# Altium schematic sheet MM32F5277.SchDoc
size A2
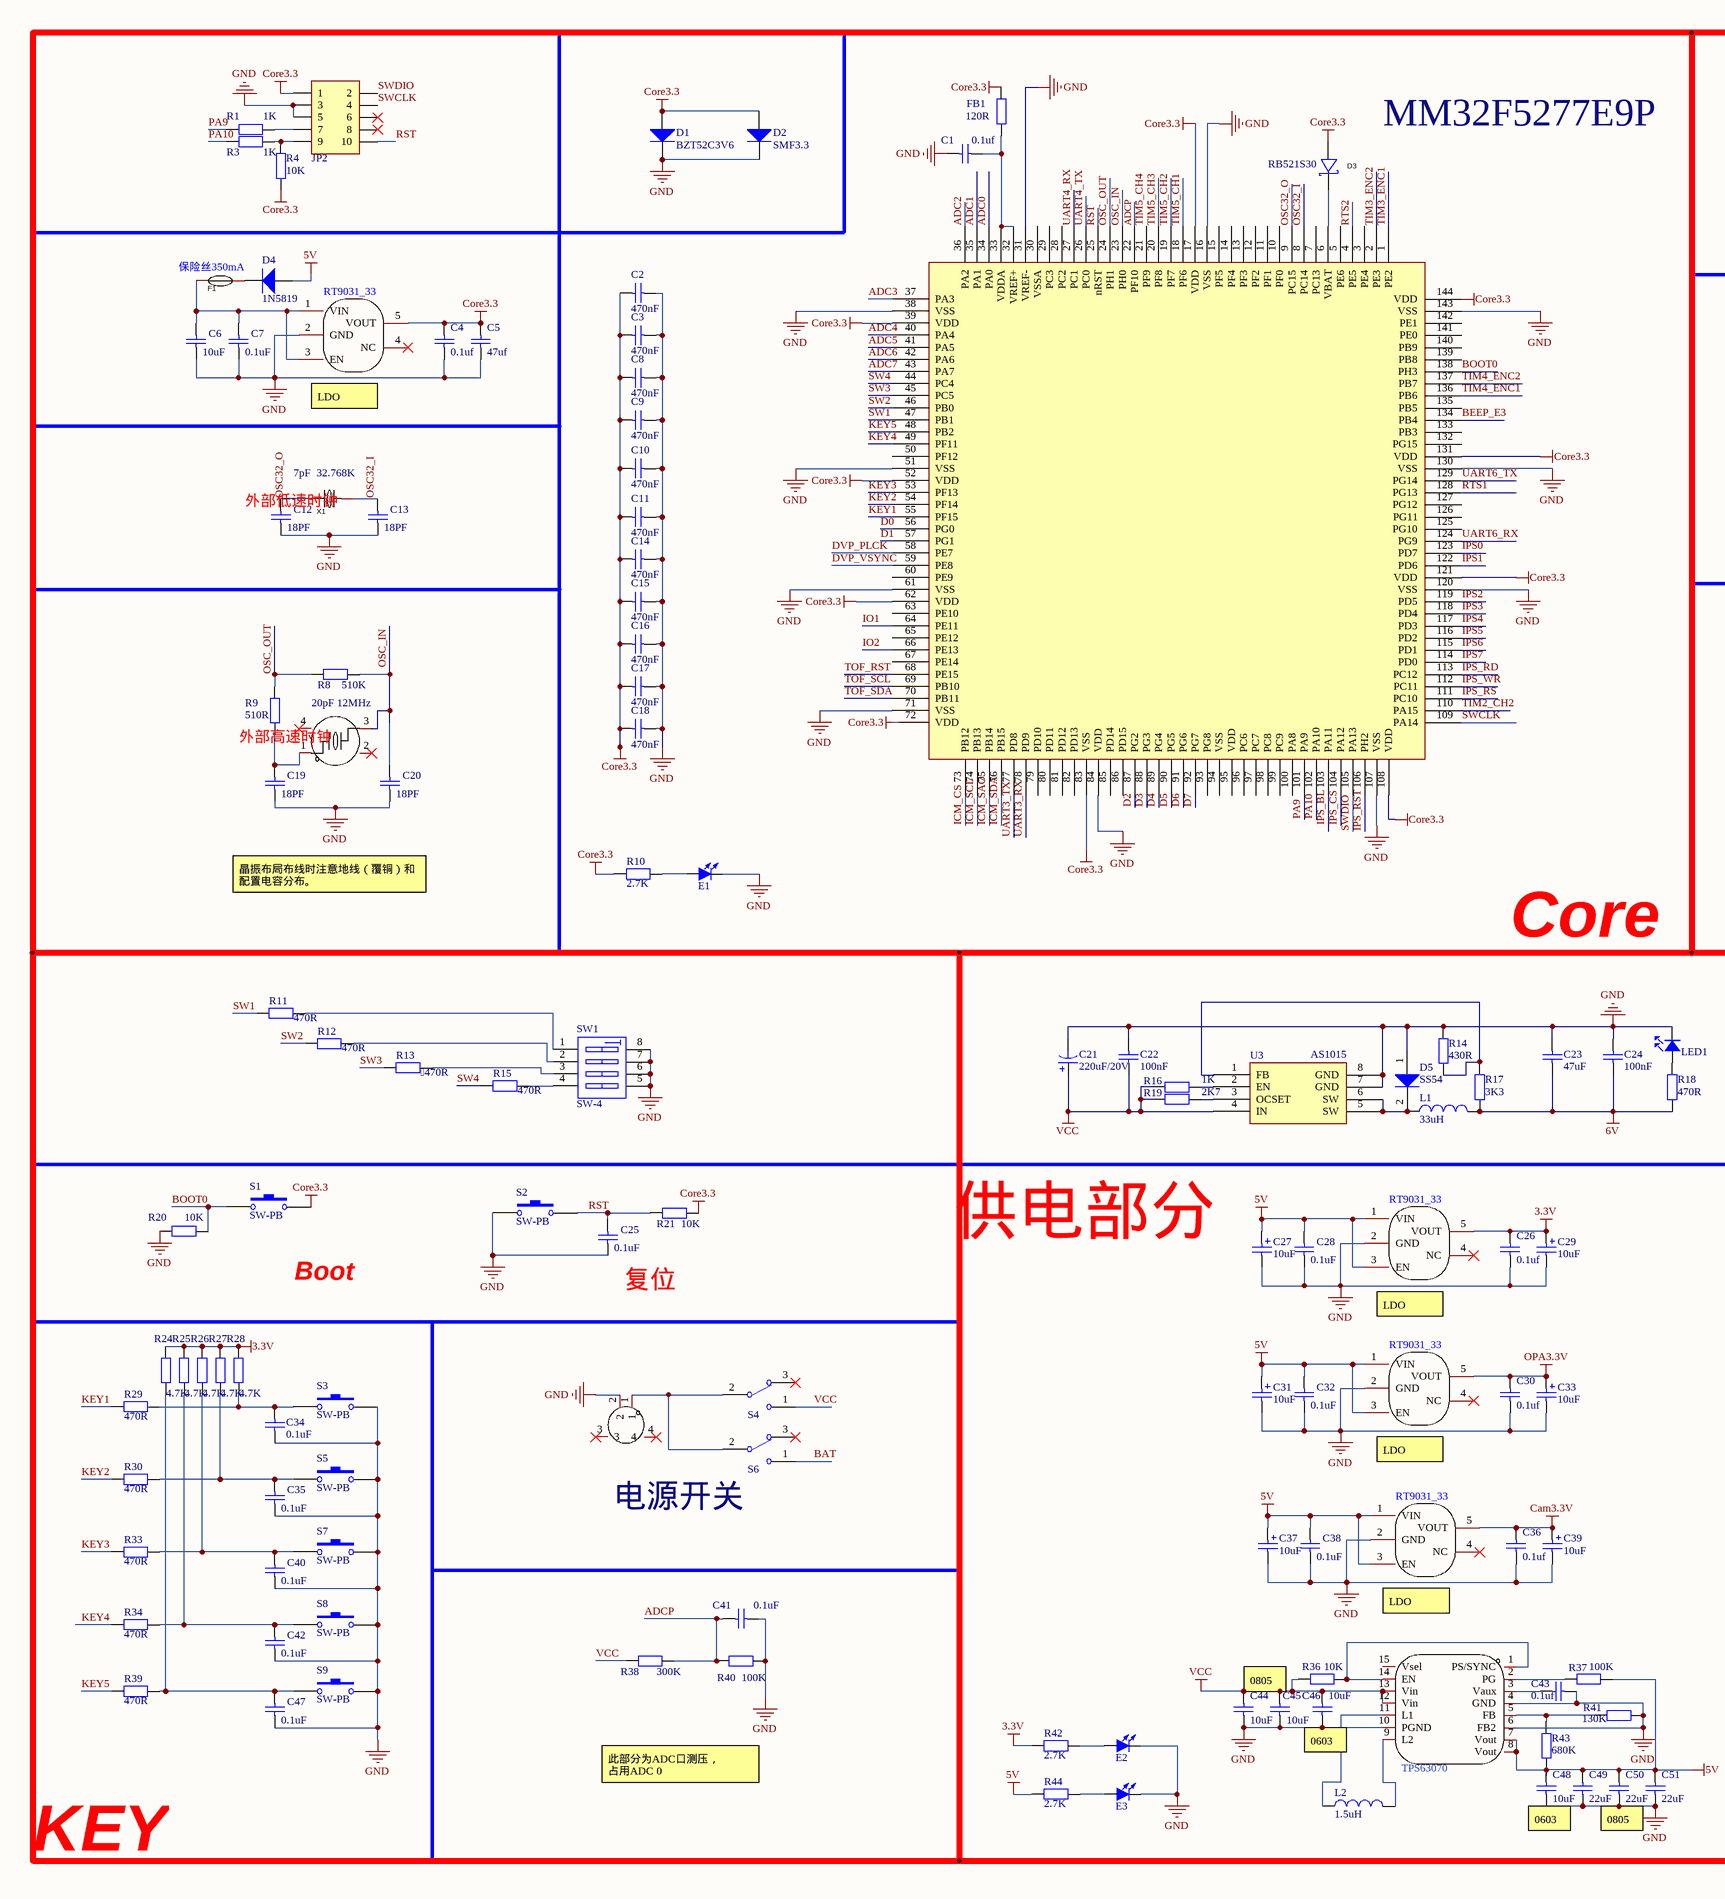
[diagram p0: MM32F5277.SchDoc, left]
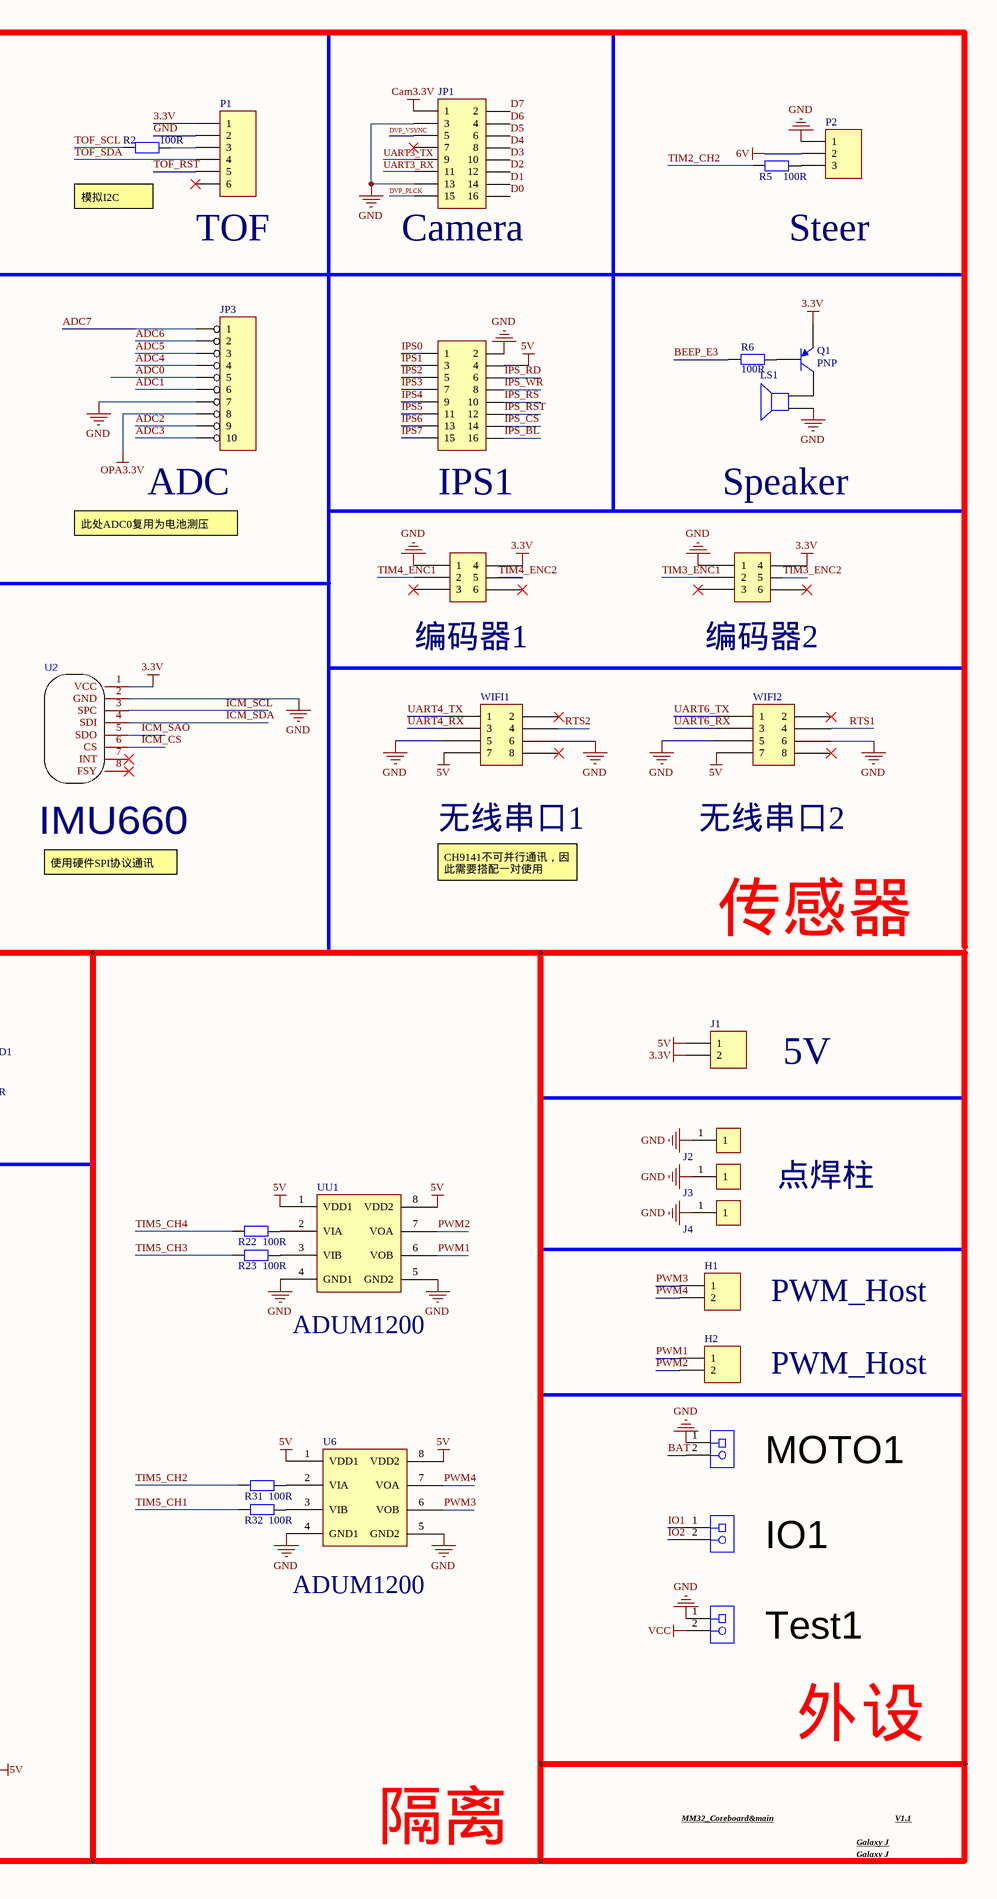
[diagram p1: MM32F5277.SchDoc, right]

## Parts
*1  MM32F5277E9P  [LQFP-144_L20.0-W20.0-P0.50-LS22.0-BL]
C1  value 0.1uf  [C 0603_L]  (hidden comment: Cap_4_1)
C2  Cap_3  [C 0603_L]  (value not drawn)
C3  Cap_3  [C 0603_L]  (value not drawn)
C4  value 0.1uf  [C 0603_L]  (hidden comment: Cap_4_1)
C5  Cap_3  [C 0603_L]  (value not drawn)
C6  value 10uF  [C 0603_L]  (hidden comment: Cap_4_1)
C7  Cap_3  [C 0603_L]  (value not drawn)
C8  Cap_3  [C 0603_L]  (value not drawn)
C9  Cap_3  [C 0603_L]  (value not drawn)
C10  Cap_3  [C 0603_L]  (value not drawn)
C11  Cap_3  [C 0603_L]  (value not drawn)
C12  value 18PF  [C 0603_L]  (hidden comment: Cap_4_1)
C13  value 18PF  [C 0603_L]  (hidden comment: Cap_4_1)
C14  Cap_3  [C 0603_L]  (value not drawn)
C15  Cap_3  [C 0603_L]  (value not drawn)
C16  Cap_3  [C 0603_L]  (value not drawn)
C17  Cap_3  [C 0603_L]  (value not drawn)
C18  Cap_3  [C 0603_L]  (value not drawn)
C19  value 18PF  [C 0603_L]  (hidden comment: Cap_4_1)
C20  value 18PF  [C 0603_L]  (hidden comment: Cap_4_1)
C21  220uF/20V  [CAP 5.0*10*12.5 - GD]
C22  100nF  [C 0603_L]
C23  47uF  [C 1206_L]
C24  100nF  [C 0603_L]
C25  Cap_3  [C 0603_L]  (value not drawn)
C26  value 0.1uf  [C 0603_L]  (hidden comment: Cap_4_1)
C27  value 10uF  [C3216A - duplicate - duplicate]  (hidden comment: Cap Pol1)
C28  Cap_3  [C 0603_L]  (value not drawn)
C29  value 10uF  [C3216A - duplicate - duplicate]  (hidden comment: Cap Pol1)
C30  value 0.1uf  [C 0603_L]  (hidden comment: Cap_4_1)
C31  value 10uF  [C3216A - duplicate - duplicate]  (hidden comment: Cap Pol1)
C32  Cap_3  [C 0603_L]  (value not drawn)
C33  value 10uF  [C3216A - duplicate - duplicate]  (hidden comment: Cap Pol1)
C34  Cap_3  [C 0603_L]  (value not drawn)
C35  Cap_3  [C 0603_L]  (value not drawn)
C36  value 0.1uf  [C 0603_L]  (hidden comment: Cap_4_1)
C37  value 10uF  [C3216A - duplicate - duplicate]  (hidden comment: Cap Pol1)
C38  Cap_3  [C 0603_L]  (value not drawn)
C39  value 10uF  [C3216A - duplicate - duplicate]  (hidden comment: Cap Pol1)
C40  Cap_3  [C 0603_L]  (value not drawn)
C41  Cap_3  [C 0603_L]  (value not drawn)
C42  Cap_3  [C 0603_L]  (value not drawn)
C43  value 0.1uf  [C 0603_L]  (hidden comment: Cap_4_1)
C44  value 10uF  [C 0805_L]  (hidden comment: Cap_4_1)
C45  value 10uF  [C 0805_L]  (hidden comment: Cap_4_1)
C46  value 10uF  [C 0603_L]  (hidden comment: Cap_4_1)
C47  Cap_3  [C 0603_L]  (value not drawn)
C48  value 10uF  [C 0603_L]  (hidden comment: Cap_4_1)
C49  value 22uF  [C 0805_L]  (hidden comment: Cap_4_1)
C50  value 22uF  [C 0805_L]  (hidden comment: Cap_4_1)
C51  value 22uF  [C 0805_L]  (hidden comment: Cap_4_1)
CN1  XT30PW-M  [XT30PW-M]  (value not drawn)
D1  BZT52C3V6  [SOD-123]
D2  SMF3.3  [SOD-123]
D3  RB521S30  [SOD-523_L1.2-W0.8-LS1.6-RD]
D4  1N5819  [SOD-123]
D5  SS54  [SMA]
E1  红色  [LED 0603]  (value not drawn)
E2  红色  [LED 0603]  (value not drawn)
E3  红色  [LED 0603]  (value not drawn)
F1  0603L050SLYR  [FU 0805]  (value not drawn)
FB1  value 120R  [R 0603_L]  (hidden comment: FB)
H1  PWM_Host  [HX2.54-2]
H2  PWM_Host  [HX2.54-2]
IO1  KF301-2P  [HDR1X2]  (value not drawn)
IPS1  Header 8X2  [HDR-8X2]  (value not drawn)
J1  5V  [HDR2.54-1X2]
J2  Column  [Column]  (value not drawn)
J3  Column  [Column]  (value not drawn)
J4  点焊柱  [Column]
JP1  Camera  [Cam_HDR2X8]
JP2  Header 5X2  [HDR2.54-LI-2x5P]  (value not drawn)
JP3  ADC  [HDR1X10]
L1  33uH  [L-SMD-0630]
L2  1.5uH  [L-SMD-0630]
LED1  LED-SM  [LED 0603]  (value not drawn)
LS1  Speaker  [BEEP 9x5.5mm]
mini1  编码器1  [DC-2.54-L-Z-6P]
mini*1  编码器2  [DC-2.54-L-Z-6P]
MOTO1  KF301-2P  [XT30UPB-F]  (value not drawn)
P1  TOF  [HDR1X6-M]
P2  Steer  [HDR2.54-LI-3P]
Q1  PNP  [SOT23-3L]
R1  value 1K  [R 0603_L]  (hidden comment: Res2)
R2  value 100R  [R 0603_L]  (hidden comment: Res2)
R3  value 1K  [R 0603_L]  (hidden comment: Res2)
R4  value 10K  [R 0603_L]  (hidden comment: Res2)
R5  value 100R  [R 0603_L]  (hidden comment: Res2)
R6  value 100R  [R 0603_L]  (hidden comment: Res2_3)
R8  value 510K  [R 0603_L]  (hidden comment: Res2)
R9  value 510R  [R 0603_L]  (hidden comment: Res2)
R10  value 2.7K  [R 0603_L]  (hidden comment: Res2_3)
R11  value 470R  [R 0603_L]  (hidden comment: Res2)
R12  value 470R  [R 0603_L]  (hidden comment: Res2)
R13  value 470R  [R 0603_L]  (hidden comment: Res2)
R14  430R  [R 0603_L]
R15  value 470R  [R 0603_L]  (hidden comment: Res2)
R16  1K  [R 0603_L]
R17  3K3  [R 0603_L]
R18  470R  [R 0603_L]
R19  2K7  [R 0603_L]
R20  value 10K  [R 0603_L]  (hidden comment: Res2)
R21  value 10K  [R 0603_L]  (hidden comment: Res2)
R22  value 100R  [R 0603_L]  (hidden comment: Res2)
R23  value 100R  [R 0603_L]  (hidden comment: Res2)
R24  value 4.7K  [R 0603_L]  (hidden comment: Res2)
R25  value 4.7K  [R 0603_L]  (hidden comment: Res2)
R26  value 4.7K  [R 0603_L]  (hidden comment: Res2)
R27  value 4.7K  [R 0603_L]  (hidden comment: Res2)
R28  value 4.7K  [R 0603_L]  (hidden comment: Res2)
R29  value 470R  [R 0603_L]  (hidden comment: Res2)
R30  value 470R  [R 0603_L]  (hidden comment: Res2)
R31  value 100R  [R 0603_L]  (hidden comment: Res2)
R32  value 100R  [R 0603_L]  (hidden comment: Res2)
R33  value 470R  [R 0603_L]  (hidden comment: Res2)
R34  value 470R  [R 0603_L]  (hidden comment: Res2)
R36  value 10K  [R 0603_L]  (hidden comment: Res2_3)
R37  value 100K  [R 0603_L]  (hidden comment: Res2_3)
R38  value 300K  [R 0603_L]  (hidden comment: Res2)
R39  value 470R  [R 0603_L]  (hidden comment: Res2)
R40  value 100K  [R 0603_L]  (hidden comment: Res2)
R41  value 130K  [R 0603_L]  (hidden comment: Res2_3)
R42  value 2.7K  [R 0603_L]  (hidden comment: Res2_3)
R43  value 680K  [R 0603_L]  (hidden comment: Res2_3)
R44  value 2.7K  [R 0603_L]  (hidden comment: Res2_3)
S1  SW-PB  [PTS810-3*4-CurvePin]
S2  SW-PB  [PTS810-3*4-CurvePin]
S3  SW-PB  [PTS810-3*4-CurvePin]
S4  SW-SPDT  [SS12D10]  (value not drawn)
S5  SW-PB  [PTS810-3*4-CurvePin]
S6  SW-SPDT  [SS12D10]  (value not drawn)
S7  SW-PB  [PTS810-3*4-CurvePin]
S8  SW-PB  [PTS810-3*4-CurvePin]
S9  SW-PB  [PTS810-3*4-CurvePin]
SW1  SW-4  [SOP-KEY4]
Test1  KF301-2P  [HDR2.54-1X2 - duplicate1]  (value not drawn)
U1  RT9013-33GB  [SOT-23-5]  (value not drawn)
U2  IMU660  [HDR1X6-M]
U3  AS1015  [SOP8_L]
U4  RT9013-33GB  [SOT-23-5]  (value not drawn)
U5  RT9013-33GB  [SOT-23-5]  (value not drawn)
U6  ADUM1200  [SOP8_L]
U7  RT9013-33GB  [SOT-23-5]  (value not drawn)
U8  TPS63070RNMR  [VQFN-HR-15_L3.0-W2.5-P0.50-BL_TPS63070RNMR]  (value not drawn)
UU1  ADUM1200  [SOP8_L]
WIFI1  无线串口1  [HDR2.54-LI-2x4P]
WIFI2  无线串口2  [HDR2.54-LI-2x4P]
X1  7pF  32.768K  [OSC 3215-2P]
X2  20pF 12MHz  [X3225-4]

## Nets
3.3V: C26.2 C29.1 J1.2 mini1.4 mini*1.4 P1.1 Q1.3(E) R24.1 R25.1 R26.1 R27.1 R28.1 R42.1 U2.1(VCC) U4.5(VOUT)
5V: C27.1 C28.2 C31.1 C32.2 C37.1 C38.2 C48.2 C49.1 C50.2 C51.2 D4.A IPS1.4 J1.1 R37.1 R43.1 R44.1 U4.1(VIN) U4.3(EN) U5.1(VIN) U5.3(EN) U6.1(VDD1) U6.8(VDD2) U7.1(VIN) U7.3(EN) U8.7(Vout) U8.8(Vout) UU1.1(VDD1) UU1.8(VDD2) WIFI1.7 WIFI2.7
6V: C23.1 C24.1 L1.2 P2.2 R17.1 R18.2
Cam3.3V: C36.2 C39.1 JP1.1 U7.5(VOUT)
Core3.3: *1.17(VDD) *1.39(VDD) *1.52(VDD) *1.62(VDD) *1.72(VDD) *1.83(VSS) *1.108(VDD) *1.121(VDD) *1.131(VDD) *1.144(VDD) C2.2 C3.2 C4.2 C5.2 C8.2 C9.2 C10.2 C11.2 C14.2 C15.2 C16.2 C17.2 C18.2 D1.A D2.A D3.2(A) FB1.2 JP2.1 R4.1 R10.1 R21.2 S1.2 U1.5(VOUT)
GND: *1.16(VSS) *1.31(VREF-) *1.38(VSS) *1.51(VSS) *1.61(VSS) *1.71(VSS) *1.84(VDD) *1.107(VSS) *1.120(VSS) *1.130(VSS) *1.143(VSS) C1.2 C2.1 C3.1 C4.1 C5.1 C6.1 C7.1 C8.1 C9.1 C10.1 C11.1 C12.1 C13.1 C14.1 C15.1 C16.1 C17.1 C18.1 C19.1 C20.1 C21.2 C22.2 C23.2 C24.2 C25.1 C26.1 C27.2 C28.1 C29.2 C30.1 C31.2 C32.1 C33.2 C34.1 C35.1 C36.1 C37.2 C38.1 C39.2 C40.1 C41.1 C42.1 C43.1 C44.1 C45.1 C46.1 C47.1 C48.1 C49.2 C50.1 C51.1 CN1.2 D1.K D2.K D5.1(A) E1.2(K) E2.2(K) E3.2(K) IPS1.2 J2.1 J3.1 J4.1 JP1.3 JP1.13 JP2.3 JP2.5 JP3.7 LED1.2 LS1.1 mini1.1 mini*1.1 MOTO1.1 P1.2 P2.1 R14.2 R20.1 R40.2 R41.2 S2.1 S3.2 S5.2 S7.2 S8.2 S9.2 SW1.5(B4) SW1.6(B3) SW1.7(B2) SW1.8(B1) Test1.1 U1.2(GND) U2.2(GND) U3.7(GND) U3.8(GND) U4.2(GND) U5.2(GND) U6.4(GND1) U6.5(GND2) U7.2(GND) U8.4(GND) U8.6(FB2) U8.10(PGND) UU1.4(GND1) UU1.5(GND2) WIFI1.5 WIFI1.6 WIFI2.5 WIFI2.6
OPA3.3V: C30.2 C33.1 JP3.8 U5.5(VOUT)
VCC: C21.1 C22.1 C44.2 C45.2 C46.2 R16.2 R19.2 R36.2 R38.1 S4.1 Test1.2 U3.4(IN) U8.12(Vin) U8.13(Vin)
ADC0: *1.34(PA0) JP3.5
ADC1: *1.35(PA1) JP3.6
ADC2: *1.36(PA2) JP3.9
ADC3: *1.37(PA3) JP3.10
ADC4: *1.40(PA4) JP3.4
ADC5: *1.41(PA5) JP3.3
ADC6: *1.42(PA6) JP3.2
ADC7: *1.43(PA7) JP3.1
ADCP: *1.22(PF10) C41.2 R38.2 R40.1
BAT: MOTO1.2 S6.1
BEEP_E3: *1.134(PB4) R6.1
BOOT0: *1.138(PH3) R20.2 S1.1
D0: *1.56(PG0) JP1.16
D1: *1.57(PG1) JP1.14
D2: *1.87(PG2) JP1.12
D3: *1.88(PG3) JP1.10
D4: *1.89(PG4) JP1.8
D5: *1.90(PG5) JP1.6
D6: *1.91(PG6) JP1.4
D7: *1.92(PG7) JP1.2
DVP_PLCK: *1.58(PE7) JP1.15
DVP_VSYNC: *1.59(PE8) JP1.5
ICM_CS: *1.73(PB12) U2.6(CS)
ICM_SAO: *1.75(PB14) U2.5(SDO)
ICM_SCL: *1.74(PB13) U2.3(SPC)
ICM_SDA: *1.76(PB15) U2.4(SDI)
IO1: *1.64(PE11) IO1.1
IO2: *1.66(PE13) IO1.2
IPS0: *1.123(PD7) IPS1.1
IPS1: *1.122(PD6) IPS1.3
IPS2: *1.119(PD5) IPS1.5
IPS3: *1.118(PD4) IPS1.7
IPS4: *1.117(PD3) IPS1.9
IPS5: *1.116(PD2) IPS1.11
IPS6: *1.115(PD1) IPS1.13
IPS7: *1.114(PD0) IPS1.15
IPS_BL: *1.103(PA11) IPS1.16
IPS_CS: *1.104(PA12) IPS1.14
IPS_RD: *1.113(PC12) IPS1.6
IPS_RS: *1.111(PC10) IPS1.10
IPS_RST: *1.106(PH2) IPS1.12
IPS_WR: *1.112(PC11) IPS1.8
KEY1: *1.55(PF15) R29.1
KEY2: *1.54(PF14) R30.1
KEY3: *1.53(PF13) R33.1
KEY4: *1.49(PF11) R34.1
KEY5: *1.48(PB2) R39.1
OSC32_I: *1.8(PC14) C13.2 X1.1
OSC32_O: *1.9(PC15) C12.2 X1.2
OSC_IN: *1.23(PH0) C20.2 R8.2 X2.3
OSC_OUT: *1.24(PH1) R8.1 R9.2
PA9: *1.101(PA9) R1.1
PA10: *1.102(PA10) R3.1
PWM1: H2.1 UU1.6(VOB)
PWM2: H2.2 UU1.7(VOA)
PWM3: H1.1 U6.6(VOB)
PWM4: H1.2 U6.7(VOA)
RST: *1.25(nRST) C25.2 JP2.10 R21.1 S2.2
RTS1: *1.128(PG13) WIFI2.4
RTS2: *1.4(PE5) WIFI1.4
SW1: *1.47(PB1) R11.1
SW2: *1.46(PB0) R12.1
SW3: *1.45(PC5) R13.1
SW4: *1.44(PC4) R15.1
SWCLK: *1.109(PA14) JP2.4
SWDIO: *1.105(PA13) JP2.2
TIM2_CH2: *1.110(PA15) R5.1
TIM3_ENC1: *1.1(PE2) mini*1.2
TIM3_ENC2: *1.2(PE3) mini*1.5
TIM4_ENC1: *1.136(PB6) mini1.2
TIM4_ENC2: *1.137(PB7) mini1.5
TIM5_CH1: *1.18(PF6) R32.1
TIM5_CH2: *1.19(PF7) R31.1
TIM5_CH3: *1.20(PF8) R23.1
TIM5_CH4: *1.21(PF9) R22.1
TOF_RST: *1.68(PE15) P1.5
TOF_SCL: *1.69(PB10) R2.1
TOF_SDA: *1.70(PB11) P1.4
UART3_RX: *1.78(PD9) JP1.11
UART3_TX: *1.77(PD8) JP1.9
UART4_RX: *1.27(PC1) WIFI1.3
UART4_TX: *1.26(PC0) WIFI1.1
UART6_RX: *1.124(PG9) WIFI2.3
UART6_TX: *1.129(PG14) WIFI2.1
Net*1_6: *1.6(VBAT) D3.1(K)
Net*1_32: *1.32(VREF+) *1.33(VDDA) C1.1 FB1.1
NetC6_2: C6.2 C7.2 F1.1 U1.1(VIN) U1.3(EN)
NetC19_2: C19.2 R9.1 X2.1
NetC34_2: C34.2 R28.2 R29.2 S3.1
NetC35_2: C35.2 R27.2 R30.2 S5.1
NetC40_2: C40.2 R26.2 R33.2 S7.1
NetC42_2: C42.2 R25.2 R34.2 S8.1
NetC43_2: C43.2 U8.3(Vaux)
NetC47_2: C47.2 R24.2 R39.2 S9.1
NetCN1_1: CN1.1 S4.2 S6.2
NetD4_K: D4.K F1.2
NetD5_2: D5.2(K) L1.1 U3.5(SW) U3.6(SW)
NetE1_1: E1.1(A) R10.2
NetE2_1: E2.1(A) R42.2
NetE3_1: E3.1(A) R44.2
NetJP2_7: JP2.7 R1.2
NetJP2_9: JP2.9 R3.2 R4.2
NetL2_1: L2.1 U8.11(L1)
NetL2_2: L2.2 U8.9(L2)
NetLED1_1: LED1.1 R18.1
NetLS1_2: LS1.2 Q1.1(C)
NetP1_3: P1.3 R2.2
NetP2_3: P2.3 R5.2
NetQ1_2: Q1.2(B) R6.2
NetR11_2: R11.2 SW1.1(A1)
NetR12_2: R12.2 SW1.2(A2)
NetR13_2: R13.2 SW1.3(A3)
NetR14_1: R14.1 R17.2 U3.1(FB)
NetR15_2: R15.2 SW1.4(A4)
NetR16_1: R16.1 U3.2(EN)
NetR19_1: R19.1 U3.3(OCSET)
NetR22_2: R22.2 UU1.2(VIA)
NetR23_2: R23.2 UU1.3(VIB)
NetR31_2: R31.2 U6.2(VIA)
NetR32_2: R32.2 U6.3(VIB)
NetR36_1: R36.1 U8.1(PS/SYNC) U8.14(EN)
NetR37_2: R37.2 U8.2(PG)
NetR41_1: R41.1 R43.2 U8.5(FB)

Not connected (* = marked no-connect by the designer): *1 3(PE4) 5(PE6) 7(PC13) 10(PF0) 11(PF1) 12(PF2) 13(PF3) 14(PF4) 15(PF5) 28(PC2) 29(PC3) 30(VSSA) 50(PF12) 60(PE9) 63(PE10) 65(PE12) 67(PE14) 79(PD10) 80(PD11) 81(PD12) 82(PD13) 85(PD14) 86(PD15) 93(PG8) 94(VSS) 95(VDD) 96(PC6) 97(PC7) 98(PC8) 99(PC9) 100(PA8) 125(PG10) 126(PG11) 127(PG12) 132(PG15) 133(PB3) 135(PB5) 139(PB8) 140(PB9) 141(PE0) 142(PE1); CN1 3* 4*; JP1 7*; JP2 6* 8*; mini1 3* 6*; mini*1 3* 6*; P1 6*; S4 3*; S6 3*; U1 4(NC)*; U2 7(INT)* 8(FSY)*; U4 4(NC)*; U5 4(NC)*; U7 4(NC)*; U8 15(Vsel); WIFI1 2* 8*; WIFI2 2* 8*; X2 2(GND)* 4(GND)*

## Notes on the sheet
- (near R2) 模拟I2C
- (near F1) 保险丝350mA
- (near U1) RT9031_33
- (near U1) LDO
- (near C12) 外部低速时钟
- 此处ADC0复用为电池测压
- 外部高速时钟
- 晶振布局布线时注意地线（覆铜）和配置电容分布。
- 使用硬件SPI协议通讯
- CH9141不可并行通讯，因此需要搭配一对使用
- Core
- 传感器
- 供电部分
- (near U4) RT9031_33
- Boot
- (near C25) 复位
- (near U4) LDO
- (near U5) RT9031_33
- (near U5) LDO
- (near CN1) 电源开关
- (near U7) RT9031_33
- (near U7) LDO
- 0805
- 此部分为ADC口测压，
  占用ADC 0
- (near C46) 0603
- (near U8) TPS63070
- 外设
- 0603
- 隔离
- MM32_Coreboard&main
- Galaxy J
- V1.1
- KEY
- (in symbol Cap_3) 0.1uF; 47uf; 470nF

## Library data of the parts
*1 = MM32F3277G9P
C2 C3 C5 C7-C11 C14-C18 C25 C28 C32 C34 C35 C38 C40-C42 C47 = Cap_3: Capacitor
C21 = Cap Pol1: Polarized Capacitor (Radial); Value: 1uF; Published: 8-Jun-2000; LatestRevisionDate: 17-Jul-2002; LatestRevisionNote: Re-released for DXP Platform.; PackageReference: RB7.6-15; Publisher: Altium Limited; PackageDescription: Polarized Capacitor (Radial); 2 Leads
C22-C24 = Cap: Capacitor; Value: 0.1uF; Published: 8-Jun-2000; LatestRevisionDate: 17-Jul-2002; LatestRevisionNote: Re-released for DXP Platform.; PackageReference: RAD-0.3; Publisher: Altium Limited
C27 C29 C31 C33 C37 C39 = Cap Pol1_1: Polarized Capacitor (Radial); Published: 8-Jun-2000; LatestRevisionDate: 17-Jul-2002; LatestRevisionNote: Re-released for DXP Platform.; PackageReference: RB7.6-15; Publisher: Altium Limited; PackageDescription: Polarized Capacitor (Radial); 2 Leads
CN1 = XT30PW-M: Manufacturer: AMASS(艾迈斯); Add into BOM: yes; Name: XT30PW-M; Symbol: XT30PW-M; Device: XT30PW-M; LCSC Part Name: XT30PW-M公头; Supplier Part: C431092; Manufacturer Part: XT30PW-M; Supplier Footprint: Through Hole; JLCPCB Part Class: Extended Part; Datasheet: https://atta.szlcsc.com/upload/public/pdf/source/20220222/6A9F22F7850E25B33E1BE430ADF8560B.pdf; Supplier: LCSC; Convert to PCB: yes
D1 D2 D4 = Diode 1N4148: SMT Glass Diode, PSpice Model; Imax: 500mA; Published: 8-Jun-2000; Publisher: Altium Limited; Price(RMB): 0.000
  D1: PartNumber: BZT52C3V6
  D2: PartNumber: SMF3.3
  D4: PartNumber: 1N5819
D3 = RB521S30: Manufacturer: onsemi(安森美); Symbol: RB521S30_C232844; Add into BOM: yes; Reverse Voltage (Vr): 30V; Average Rectified Current (Io): 200mA; Forward Voltage (Vf@If): 500mV@200mA; Name: RB521S30; Device: RB521S30; LCSC Part Name: 30V 200mA 500mV@200mA; Supplier Part: C232844; Manufacturer Part: RB521S30; Supplier Footprint: SOD-523; JLCPCB Part Class: Extended Part; Datasheet: https://atta.szlcsc.com/upload/public/pdf/source/20181222/C232844_E4370A21097FA32ADEEDD4DF849FC10A.pdf; Supplier: LCSC; Convert to PCB: yes
D5 = Diode 1N5408: 3 Amp Medium Power Silicon Rectifier Diode; Published: 8-Jun-2000; LatestRevisionDate: 17-Jul-2002; LatestRevisionNote: Re-released for DXP Platform.; DatasheetVersion: Aug-1984; PackageReference: DO-201AD; Publisher: Altium Limited; PackageDescription: Diode, Axial; Body 9.5 x 5.3 mm (LxDia. max), Lead Dia. 1.32 mm (max); ComponentLink1Description: Manufacturer Link; ComponentLink1URL: http://www.irf.com/
E1-E3 = LED-SMD: 贴片LED; 版权归属: 黎明电子style; BOM名称: 贴片LED; 学习资源: https://lmdzstyle.taobao.com/
F1 = 0603L050SLYR: Manufacturer: Littelfuse(美国力特); Add into BOM: yes; Operating Voltage (Max): 6V; Current Rating (Max): 50A; Hold Current: 500mA; Trip Current: 1A; Resistance - Initial (Ri) (Min): 70mΩ; Resistance - Post Trip (R1) (Max): 350mΩ; Maximum Time to Trip: 100ms; Name: 0603L050SLYR; Symbol: 0603L050SLYR; Device: 0603L050SLYR; LCSC Part Name: 500mA 6V; Supplier Part: C207014; Manufacturer Part: 0603L050SLYR; Supplier Footprint: 0603; JLCPCB Part Class: Extended Part; Datasheet: https://atta.szlcsc.com/upload/public/pdf/source/20190415/C207014_60F035698ADFC68D0602847B49AF3DCE.pdf; Supplier: LCSC; Convert to PCB: yes; Power Dissipation: -; Operating Temperature: -40℃~+85℃
FB1 = Res2: Published: 8-Jun-2000; LatestRevisionDate: 17-Jul-2002; LatestRevisionNote: Re-released for DXP Platform.; PackageReference: AXIAL-0.4; Publisher: Altium Limited; PackageDescription: Axial Device, Thru-Hole; 2 Leads; 0.4 in Pin Spacing
H1 H2 J1 = Header 2: Header, 2-Pin; LatestRevisionDate: 17-Jul-2002; LatestRevisionNote: Re-released for DXP Platform.; Publisher: Altium Limited
IO1 = 691 101 710 001: IO; PartNumber: 691 101 710 002; Manufacturer: Wurth Elektronik eiSos; SymbolCreator: a0412235; CompType: Terminal Block; U/M: EA; SymbolVersion: 2013-09-04; PackageReference: Terminal Block, 5 mm, 2x1, TH; RoHS: Y; MountType: TH; ComponentLink1Description: Datasheet Link; ComponentLink1URL: http://katalog.we-online.de/em/datasheet/6911017100xx.pdf; Publisher: Texas Instruments; LatestRevisionDate: 2015-02-03; Supplier 1: Digi-Key; Supplier Part Number 1: 732-2026-ND; Supplier 2: Mouser; Supplier Part Number 2: 710-691101710002
IPS1 = Header 8X2: 8*2P接插件; 版权归属: 黎明电子style; BOM名称: 8*2P接插件; 学习资源: https://lmdzstyle.taobao.com/
J2-J4 mini1 mini*1 = Component_1
JP2 = Header 5X2: 5*2P接插件; 淘宝ID: 小糖豆的小窝窝; BOM名称: 5*2P接插件; 下单链接: https://item.taobao.com/item.htm?ft=t&id=613637044352
JP3 = HEADER 10
L1 L2 = Inductor: Code_IEC: 1005; Value: 10mH; Published: 8-Jun-2000; LatestRevisionDate: 29-May-2009; LatestRevisionNote: IPC-7351 Footprint Added.; PackageReference: 0402-A; Publisher: Altium Limited; PackageDescription: Chip Inductor; Code_JEITA: 0402
LS1 = Speaker: Loudspeaker; Published: 24-Mar-1999; LatestRevisionDate: 17-Jul-2002; LatestRevisionNote: Re-released for DXP Platform.; PackageReference: PIN2; Publisher: Altium Limited
MOTO1 Test1 = 691 101 710 001: PartNumber: 691 101 710 002; Manufacturer: Wurth Elektronik eiSos; SymbolCreator: a0412235; CompType: Terminal Block; U/M: EA; SymbolVersion: 2013-09-04; PackageReference: Terminal Block, 5 mm, 2x1, TH; RoHS: Y; MountType: TH; ComponentLink1Description: Datasheet Link; ComponentLink1URL: http://katalog.we-online.de/em/datasheet/6911017100xx.pdf; Publisher: Texas Instruments; LatestRevisionDate: 2015-02-03; Supplier 1: Digi-Key; Supplier Part Number 1: 732-2026-ND; Supplier 2: Mouser; Supplier Part Number 2: 710-691101710002
P1 = Header 6: Header, 6-Pin; LatestRevisionDate: 17-Jul-2002; LatestRevisionNote: Re-released for DXP Platform.; Publisher: Altium Limited
P2 = Header 3: Header, 3-Pin; LatestRevisionDate: 17-Jul-2002; LatestRevisionNote: Re-released for DXP Platform.; Publisher: Altium Limited
Q1 = PNP: PNP Bipolar Transistor; Published: 8-Jun-2000; LatestRevisionDate: 29-May-2009; LatestRevisionNote: IPC-7351 Footprint Added.; PackageVersion: Aug-1999; PackageReference: SOT-23B; Publisher: Altium Limited; PackageDescription: 3-Pin SOT-23 Package 0.95 mm Pitch, 2.4 mm Lead Span
R1-R5 R8 R9 R20-R23 R31 R32 R38 R40 = Res2: Resistor; Published: 8-Jun-2000; LatestRevisionDate: 17-Jul-2002; LatestRevisionNote: Re-released for DXP Platform.; PackageReference: AXIAL-0.4; Publisher: Altium Limited; PackageDescription: Axial Device, Thru-Hole; 2 Leads; 0.4 in Pin Spacing
R11-R13 R15 R24-R30 R33 R34 R39 = Res2_2: Resistor; Published: 8-Jun-2000; LatestRevisionDate: 17-Jul-2002; LatestRevisionNote: Re-released for DXP Platform.; PackageReference: AXIAL-0.4; Publisher: Altium Limited; PackageDescription: Axial Device, Thru-Hole; 2 Leads; 0.4 in Pin Spacing
R14 R16-R19 = R6: Resistor; Published: 8-Jun-2000; LatestRevisionDate: 17-Jul-2002; LatestRevisionNote: Re-released for DXP Platform.; PackageReference: AXIAL-0.4; Publisher: Altium Limited; PackageDescription: Axial Device, Thru-Hole; 2 Leads; 0.4 in Pin Spacing
S1-S3 S5 S7-S9 = SW-PB: 微动开关; Published: 24-Mar-1999; LatestRevisionDate: 17-Jul-2002; LatestRevisionNote: Re-released for DXP Platform.; PackageReference: SPST-2; Publisher: Altium Limited
S4 S6 = SW-SPDT: 单刀双掷开关 3脚船型、钮子、拨动开关 SPDT Subminiature Toggle Switch; Published: 24-Mar-1999; Publisher: Altium Limited; Price(RMB): 0.000
U1 U4 U5 U7 = RT9013-33GB: Manufacturer: RICHTEK(台湾立锜); Add into BOM: yes; Output Type: 固定; Output Polarity: 正; Number of Outputs: 1; Maximum Input Voltage: 5.5V; Output Voltage: 3.3V; Dropout Voltage: 400mV@(500mA); Output Current: 500mA; Power Supply Rejection Ratio (PRSS): 50dB@(10kHz); Name: RT9013-33GB; Symbol: RT9013-33GB; Device: RT9013-33GB; LCSC Part Name: Vin=5.5V Vout=3.3V 500mA 50dB@(10kHz); Supplier Part: C47773; Manufacturer Part: RT9013-33GB; Supplier Footprint: SOT-23-5; JLCPCB Part Class: Extended Part; Datasheet: https://atta.szlcsc.com/upload/public/pdf/source/20150504/1457707282459.pdf; Supplier: LCSC; Convert to PCB: yes; Quiescent Current (Ground Current): -; Noise: -; Feature: -
U2 = ICM20602
U6 UU1 = ADUM1201
U8 = TPS63070RNMR: Manufacturer: TI(德州仪器); Add into BOM: yes; Function: 升降压型; Synchronous Rectification: 是; Output Type: 可调; Number of Outputs: 1; Topology: 降压式-升压式; Input Voltage: 2V~16V; Output Voltage: 2.5V~9V; Output Current (Max): 3.6A; Switching Frequency: 2.4MHz; Name: TPS63070RNMR; Symbol: TPS63070RNMR; Device: TPS63070RNMR; LCSC Part Name: 升降压型 Vin=2V~16V Vout=2.5V~9V 3.6A; Supplier Part: C109322; Manufacturer Part: TPS63070RNMR; Supplier Footprint: VQFN-15-HR; JLCPCB Part Class: Extended Part; Supplier: LCSC; Convert to PCB: yes; Operating Temperature: -40℃~+125℃@(TJ)
WIFI1 WIFI2 = HEADER2X4
X1 = SC-32S32.768kHz20PPM12.5pF: Manufacturer: Seiko(精工); Add into BOM: yes; Name: -; Symbol: SC-32S32.768kHz20PPM12.5pF; Device: SC-32S32.768kHz20PPM12.5pF; LCSC Part Name: 32.768kHz 20PPM 12.5pF; Supplier Part: C97606; Manufacturer Part: SC-32S32.768kHz20PPM12.5pF; Supplier Footprint: SMD3215-2P; JLCPCB Part Class: Extended Part; Datasheet: https://atta.szlcsc.com/upload/public/pdf/source/20170713/C97606_1499914220652816606.pdf; Supplier: LCSC; Convert to PCB: yes; Crystal Type: -; Value: -; Frequency Tolerance: -; Frequency Stability: -; Load Capacitance: -; Operating Temperature: -
X2 = X32258MSB4SI: 12MHZ; Manufacturer: YXC扬兴科技; Name: 8MHz; Add into BOM: yes; Crystal Type: 贴片无源晶振; Value: 8MHz; Frequency Tolerance: ±10ppm; Frequency Stability: ±30ppm; Symbol: X32258MSB4SI; Device: X32258MSB4SI; LCSC Part Name: 20pF ±10ppm 8MHz; Supplier Part: C2682774; Manufacturer Part: X32258MSB4SI; Supplier Footprint: SMD3225-4P; JLCPCB Part Class: Extended Part; Datasheet: https://atta.szlcsc.com/upload/public/pdf/source/20210106/C2682774_0CD4FDA5D9DA3FBEEC23BD607A48E4B0.pdf; Supplier: LCSC; Convert to PCB: yes; Load Capacitance: 20pF; Operating Temperature: -40℃~+85℃